# Altium schematic sheet BumpSensors.SchDoc
size A
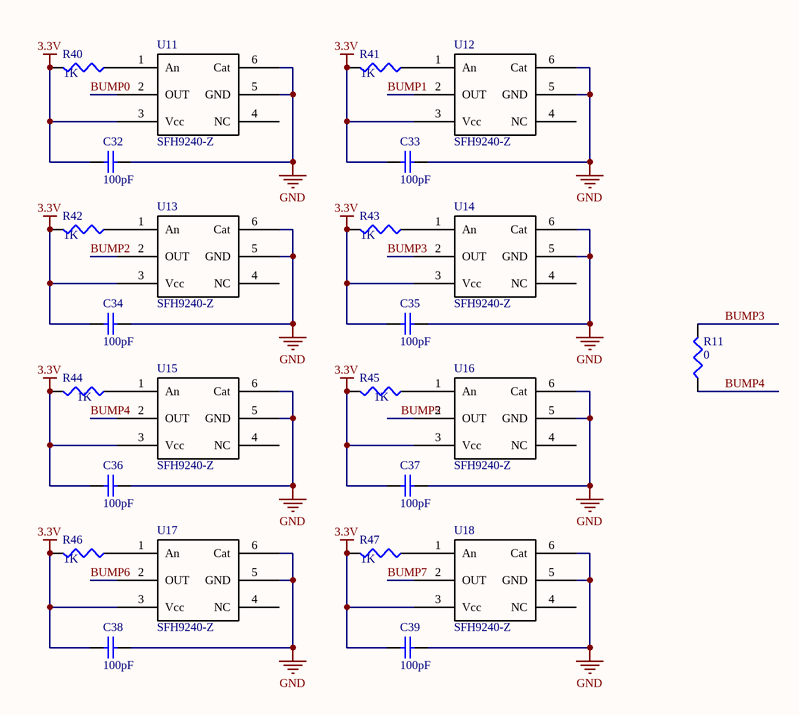
[diagram p0: BumpSensors.SchDoc]

## Parts
C32  value 100pF  [CAPC1005L]  (hidden comment: Cap Semi)
C33  value 100pF  [CAPC1005L]  (hidden comment: Cap Semi)
C34  value 100pF  [CAPC1005L]  (hidden comment: Cap Semi)
C35  value 100pF  [CAPC1005L]  (hidden comment: Cap Semi)
C36  value 100pF  [CAPC1005L]  (hidden comment: Cap Semi)
C37  value 100pF  [CAPC1005L]  (hidden comment: Cap Semi)
C38  value 100pF  [CAPC1005L]  (hidden comment: Cap Semi)
C39  value 100pF  [CAPC1005L]  (hidden comment: Cap Semi)
R11  value 0  [RESC1608L]  (hidden comment: Res3)
R40  value 1K  [RESC1608L]  (hidden comment: Res3)
R41  value 1K  [RESC1608L]  (hidden comment: Res3)
R42  value 1K  [RESC1608L]  (hidden comment: Res3)
R43  value 1K  [RESC1608L]  (hidden comment: Res3)
R44  value 1K  [RESC1608L]  (hidden comment: Res3)
R45  value 1K  [RESC1608L]  (hidden comment: Res3)
R46  value 1K  [RESC1608L]  (hidden comment: Res3)
R47  value 1K  [RESC1608L]  (hidden comment: Res3)
U11  SFH9240-Z  [SFH9240-Z]
U12  SFH9240-Z  [SFH9240-Z]
U13  SFH9240-Z  [SFH9240-Z]
U14  SFH9240-Z  [SFH9240-Z]
U15  SFH9240-Z  [SFH9240-Z]
U16  SFH9240-Z  [SFH9240-Z]
U17  SFH9240-Z  [SFH9240-Z]
U18  SFH9240-Z  [SFH9240-Z]

## Nets
3.3V: C32.2 C33.2 C34.2 C35.2 C36.2 C37.2 C38.2 C39.2 R40.2 R41.2 R42.2 R43.2 R44.2 R45.2 R46.2 R47.2 U11.3(Vcc) U12.3(Vcc) U13.3(Vcc) U14.3(Vcc) U15.3(Vcc) U16.3(Vcc) U17.3(Vcc) U18.3(Vcc)
GND: C32.1 C33.1 C34.1 C35.1 C36.1 C37.1 C38.1 C39.1 U11.5(GND) U11.6(Cat) U12.5(GND) U12.6(Cat) U13.5(GND) U13.6(Cat) U14.5(GND) U14.6(Cat) U15.5(GND) U15.6(Cat) U16.5(GND) U16.6(Cat) U17.5(GND) U17.6(Cat) U18.5(GND) U18.6(Cat)
BUMP0: U11.2(OUT)
BUMP1: U12.2(OUT)
BUMP2: U13.2(OUT)
BUMP3: R11.2 U14.2(OUT)
BUMP4: R11.1 U15.2(OUT)
BUMP5: U16.2(OUT)
BUMP6: U17.2(OUT)
BUMP7: U18.2(OUT)
NetR40_1: R40.1 U11.1(An)
NetR41_1: R41.1 U12.1(An)
NetR42_1: R42.1 U13.1(An)
NetR43_1: R43.1 U14.1(An)
NetR44_1: R44.1 U15.1(An)
NetR45_1: R45.1 U16.1(An)
NetR46_1: R46.1 U17.1(An)
NetR47_1: R47.1 U18.1(An)

Not connected (* = marked no-connect by the designer): U11 4(NC); U12 4(NC); U13 4(NC); U14 4(NC); U15 4(NC); U16 4(NC); U17 4(NC); U18 4(NC)

## Library data of the parts
C32-C39 = Cap Semi: Capacitor (Semiconductor SIM Model); Published: 8-Jun-2000; LatestRevisionDate: 29-May-2009; LatestRevisionNote: IPC-7351 Footprint Added.; PackageReference: C1206; Publisher: Altium Limited; PackageDescription: Chip Capacitor
R11 R40-R47 = Res3: Resistor; Published: 8-Jun-2000; LatestRevisionDate: 29-May-2009; LatestRevisionNote: IPC-7351 Footprint Added.; PackageReference: J1-0603; Publisher: Altium Limited; PackageDescription: Chip Resistor